# EAGLE schematic mcs-1-32 (EAGLE 6.5.0)

## Sheet 1 of 2
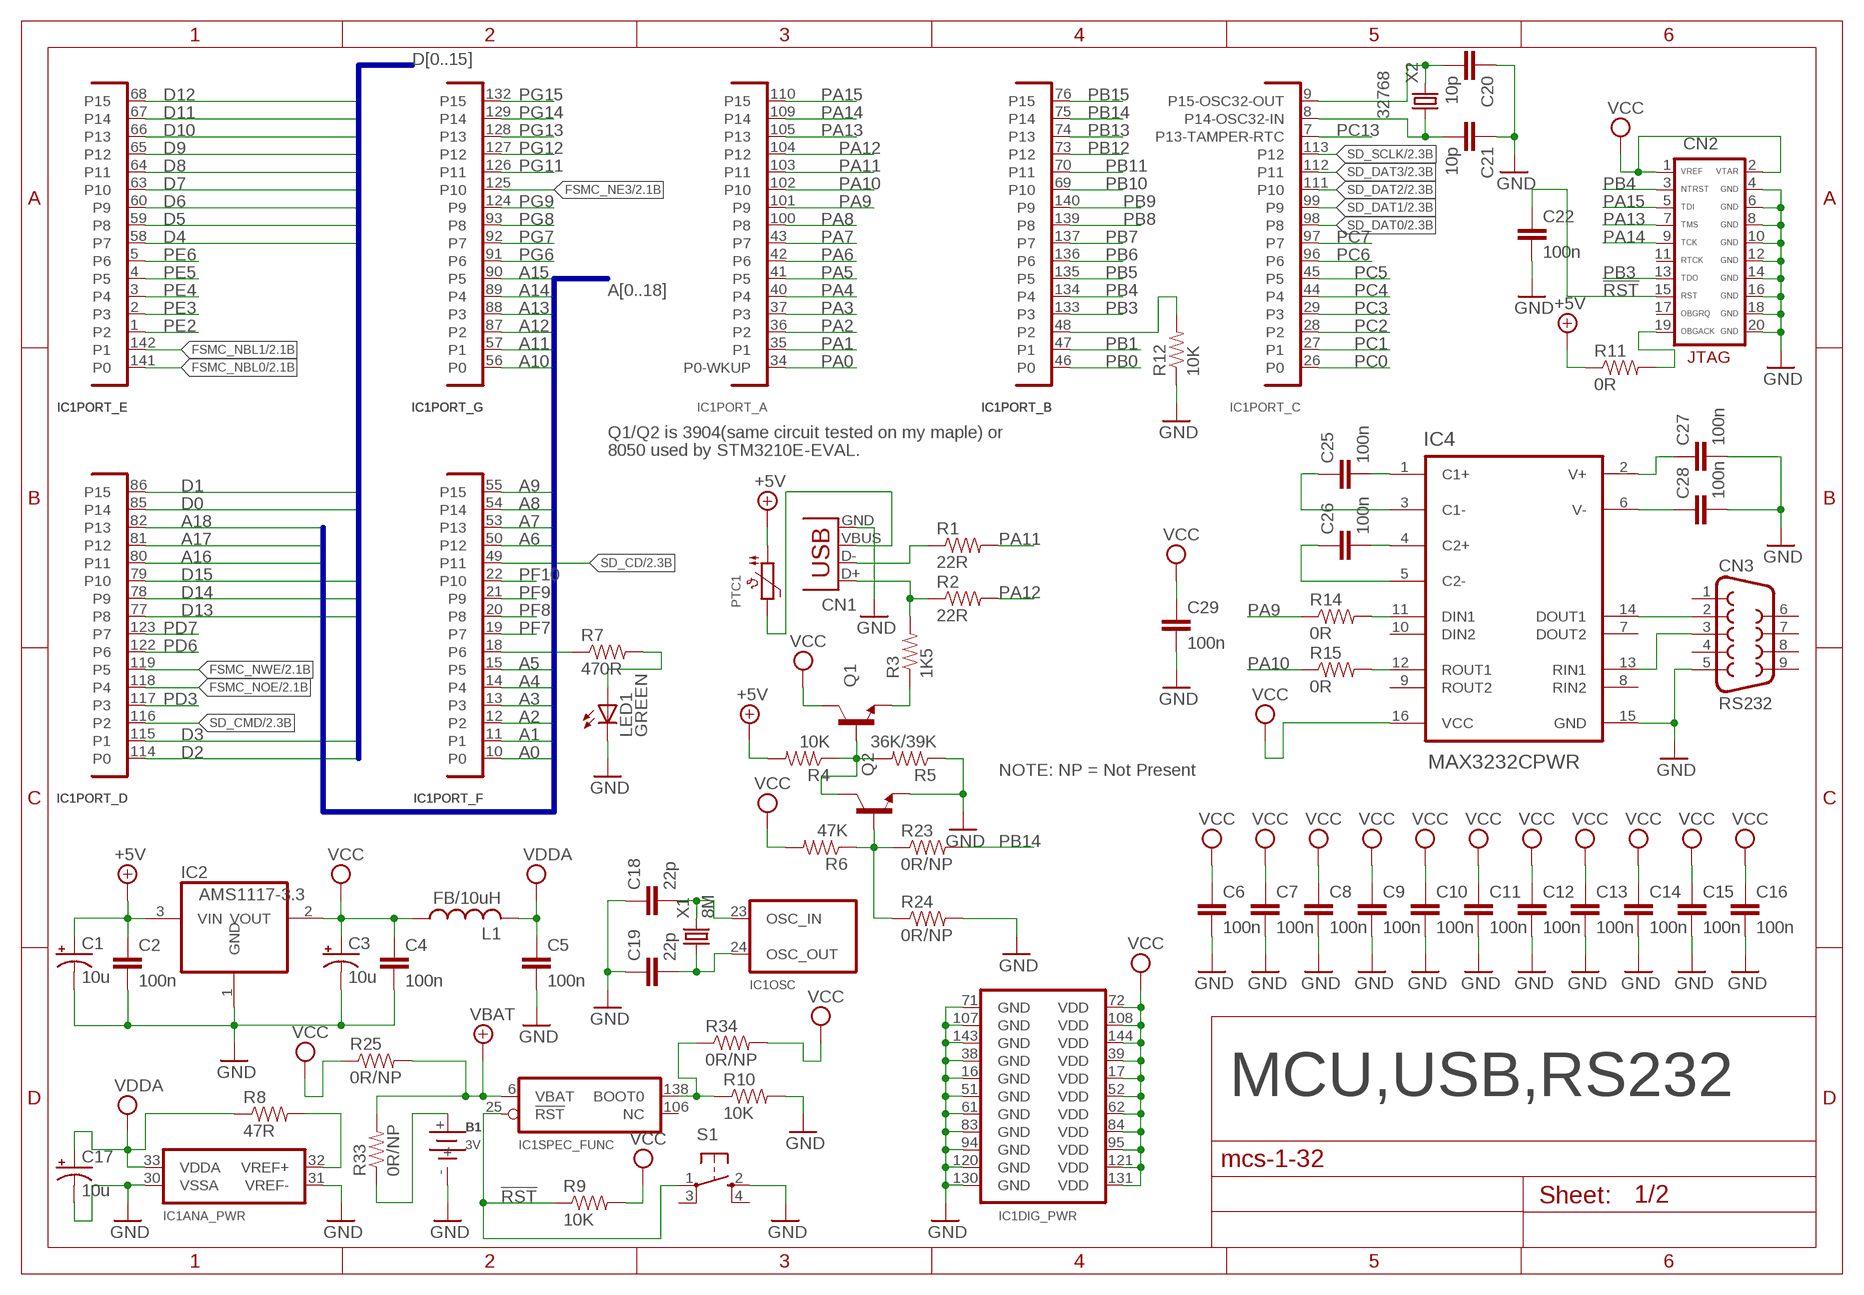
[diagram p0: schematic, sheet 1]

### Parts
B1  3V  BATTERY1220  [1220-SMD]
C1  10u  CAP_POL1206  [EIA3216]
C2  100n  CAP0603-CAP  [0603-CAP]
C3  10u  CAP_POL1206  [EIA3216]
C4  100n  CAP0603-CAP  [0603-CAP]
C5  100n  CAP0603-CAP  [0603-CAP]
C6  100n  CAP0603-CAP  [0603-CAP]
C7  100n  CAP0603-CAP  [0603-CAP]
C8  100n  CAP0603-CAP  [0603-CAP]
C9  100n  CAP0603-CAP  [0603-CAP]
C10  100n  CAP0603-CAP  [0603-CAP]
C11  100n  CAP0603-CAP  [0603-CAP]
C12  100n  CAP0603-CAP  [0603-CAP]
C13  100n  CAP0603-CAP  [0603-CAP]
C14  100n  CAP0603-CAP  [0603-CAP]
C15  100n  CAP0603-CAP  [0603-CAP]
C16  100n  CAP0603-CAP  [0603-CAP]
C17  10u  CAP_POL1206  [EIA3216]
C18  22p  CAP0603-CAP  [0603-CAP]
C19  22p  CAP0603-CAP  [0603-CAP]
C20  10p  CAP0603-CAP  [0603-CAP]
C21  10p  CAP0603-CAP  [0603-CAP]
C22  100n  CAP0603-CAP  [0603-CAP]
C25  100n  CAP0603-CAP  [0603-CAP]
C26  100n  CAP0603-CAP  [0603-CAP]
C27  100n  CAP0603-CAP  [0603-CAP]
C28  100n  CAP0603-CAP  [0603-CAP]
C29  100n  CAP0603-CAP  [0603-CAP]
CN1  USBSMD  [USB-MINIB]
CN2  JTAG-ARM-HDR100  [JTAG-ARM]
CN3  RS232  DB9FEMALE  [DB9]
IC1  STM32F103ZE  [SQFP-S-20X20-144]
IC2  AMS1117-3.3  [BURR-BROWN_SOT223]
IC4  MAX3232CPWR  [SOP65P640X120-16N]
L1  FB/10uH  L-USL2012C  [L2012C]
LED1  GREEN  LED  [CHIPLED_0805]
PTC1  PTCPTC0805  [PTC0805]
Q1  TRANSISTOR_NPNSOT23-3  [SOT23-3]
Q2  TRANSISTOR_NPNSOT23-3  [SOT23-3]
R1  22R  RESISTOR0603-RES  [0603-RES]
R2  22R  RESISTOR0603-RES  [0603-RES]
R3  1K5  RESISTOR0603-RES  [0603-RES]
R4  10K  RESISTOR0603-RES  [0603-RES]
R5  36K/39K  RESISTOR0603-RES  [0603-RES]
R6  47K  RESISTOR0603-RES  [0603-RES]
R7  470R  RESISTOR0603-RES  [0603-RES]
R8  47R  RESISTOR0603-RES  [0603-RES]
R9  10K  RESISTOR0603-RES  [0603-RES]
R10  10K  RESISTOR0603-RES  [0603-RES]
R11  0R  RESISTOR0603-RES  [0603-RES]
R12  10K  RESISTOR0603-RES  [0603-RES]
R14  0R  RESISTOR0603-RES  [0603-RES]
R15  0R  RESISTOR0603-RES  [0603-RES]
R23  0R/NP  RESISTOR0603-RES  [0603-RES]
R24  0R/NP  RESISTOR0603-RES  [0603-RES]
R25  0R/NP  RESISTOR0603-RES  [0603-RES]
R33  0R/NP  RESISTOR0603-RES  [0603-RES]
R34  0R/NP  RESISTOR0603-RES  [0603-RES]
S1  SWITCH-TACT_SFKHHM  [SWITCH-TACT_SFKHHM]
X1  8M  CRYSTALHC49US  [HC49US]
X2  32768  CRYSTAL  [CRYSTAL-32KHZ-3215]

### Nets
!RST: C22.1 CN2.15(RST) IC1.25(SPEC_FUNC:!RST) R9.1 S1.1
+5V [power_in]: C1.A(+) C2.1 IC2.3(VIN) PTC1.1 R4.2 R11.1 ; also sheet 2
A0: IC1.10(PORT_F:P0) ; also sheet 2
A1: IC1.11(PORT_F:P1) ; also sheet 2
A2: IC1.12(PORT_F:P2) ; also sheet 2
A3: IC1.13(PORT_F:P3) ; also sheet 2
A4: IC1.14(PORT_F:P4) ; also sheet 2
A5: IC1.15(PORT_F:P5) ; also sheet 2
A6: IC1.50(PORT_F:P12) ; also sheet 2
A7: IC1.53(PORT_F:P13) ; also sheet 2
A8: IC1.54(PORT_F:P14) ; also sheet 2
A9: IC1.55(PORT_F:P15) ; also sheet 2
A10: IC1.56(PORT_G:P0) ; also sheet 2
A11: IC1.57(PORT_G:P1) ; also sheet 2
A12: IC1.87(PORT_G:P2) ; also sheet 2
A13: IC1.88(PORT_G:P3) ; also sheet 2
A14: IC1.89(PORT_G:P4) ; also sheet 2
A15: IC1.90(PORT_G:P5) ; also sheet 2
A16: IC1.80(PORT_D:P11) ; also sheet 2
A17: IC1.81(PORT_D:P12) ; also sheet 2
A18: IC1.82(PORT_D:P13) ; also sheet 2
D0: IC1.85(PORT_D:P14) ; also sheet 2
D1: IC1.86(PORT_D:P15) ; also sheet 2
D2: IC1.114(PORT_D:P0) ; also sheet 2
D3: IC1.115(PORT_D:P1) ; also sheet 2
D4: IC1.58(PORT_E:P7) ; also sheet 2
D5: IC1.59(PORT_E:P8) ; also sheet 2
D6: IC1.60(PORT_E:P9) ; also sheet 2
D7: IC1.63(PORT_E:P10) ; also sheet 2
D8: IC1.64(PORT_E:P11) ; also sheet 2
D9: IC1.65(PORT_E:P12) ; also sheet 2
D10: IC1.66(PORT_E:P13) ; also sheet 2
D11: IC1.67(PORT_E:P14) ; also sheet 2
D12: IC1.68(PORT_E:P15) ; also sheet 2
D13: IC1.77(PORT_D:P8) ; also sheet 2
D14: IC1.78(PORT_D:P9) ; also sheet 2
D15: IC1.79(PORT_D:P10) ; also sheet 2
FSMC_NBL0: IC1.141(PORT_E:P0) ; also sheet 2
FSMC_NBL1: IC1.142(PORT_E:P1) ; also sheet 2
FSMC_NE3: IC1.125(PORT_G:P10) ; also sheet 2
FSMC_NOE: IC1.118(PORT_D:P4) ; also sheet 2
FSMC_NWE: IC1.119(PORT_D:P5) ; also sheet 2
GND: B1.- C1.C(-) C2.2 C3.C(-) C4.2 C5.2 C6.2 C7.2 C8.2 C9.2 C10.2 C11.2 C12.2 C13.2 C14.2 C15.2 C16.2 C17.C(-) C18.1 C19.1 C20.1 C21.1 C22.2 C27.2 C28.2 C29.2 CN1.GND CN2.4(GND) CN2.6(GND) CN2.8(GND) CN2.10(GND) CN2.12(GND) CN2.14(GND) CN2.16(GND) CN2.18(GND) CN2.20(GND) CN3.5 IC1.16(DIG_PWR:GND) IC1.30(ANA_PWR:VSSA) IC1.31(ANA_PWR:VREF-) IC1.38(DIG_PWR:GND) IC1.51(DIG_PWR:GND) IC1.61(DIG_PWR:GND) IC1.71(DIG_PWR:GND) IC1.83(DIG_PWR:GND) IC1.94(DIG_PWR:GND) IC1.107(DIG_PWR:GND) IC1.120(DIG_PWR:GND) IC1.130(DIG_PWR:GND) IC1.143(DIG_PWR:GND) IC2.1(GND) IC4.15(GND) LED1.C Q2.2(E) R5.1 R10.2 R12.1 R24.2 S1.2 ; also sheet 2
N$1: Q1.2(E) R3.1
N$2: Q1.1(B) Q2.3(C) R4.1 R5.2
N$3: Q2.1(B) R6.1 R23.1 R24.1
N$4: CN1.D- R1.1
N$5: CN1.D+ R2.1 R3.2
N$6: IC1.18(PORT_F:P6) R7.1
N$7: LED1.A R7.2
N$8: IC1.32(ANA_PWR:VREF+) R8.2
N$9: IC1.138(SPEC_FUNC:BOOT0) R10.1 R34.1
N$10: IC1.48(PORT_B:P2) R12.2
N$11: B1.+ R33.1
N$12: C18.2 IC1.23(OSC:OSC_IN) X1.2
N$13: C19.2 IC1.24(OSC:OSC_OUT) X1.1
N$14: C20.2 IC1.9(PORT_C:P15-OSC32-OUT) X2.2
N$15: C21.2 IC1.8(PORT_C:P14-OSC32-IN) X2.1
N$16: CN2.19(OBGACK) R11.2
N$17: IC4.11(DIN1) R14.2
N$18: IC4.12(ROUT1) R15.2
N$19 [power]: CN1.VBUS PTC1.2
N$20: CN3.2 IC4.14(DOUT1)
N$21: CN3.3 IC4.13(RIN1)
N$23: C25.2 IC4.1(C1+)
N$24: C25.1 IC4.3(C1-)
N$25: C26.2 IC4.4(C2+)
N$26: C26.1 IC4.5(C2-)
N$27: C27.1 IC4.2(V+)
N$28: C28.1 IC4.6(V-)
PA0: IC1.34(PORT_A:P0-WKUP) ; also sheet 2
PA1: IC1.35(PORT_A:P1) ; also sheet 2
PA2: IC1.36(PORT_A:P2) ; also sheet 2
PA3: IC1.37(PORT_A:P3) ; also sheet 2
PA4: IC1.40(PORT_A:P4) ; also sheet 2
PA5: IC1.41(PORT_A:P5) ; also sheet 2
PA6: IC1.42(PORT_A:P6) ; also sheet 2
PA7: IC1.43(PORT_A:P7) ; also sheet 2
PA8: IC1.100(PORT_A:P8) ; also sheet 2
PA9: IC1.101(PORT_A:P9) R14.1
PA10: IC1.102(PORT_A:P10) R15.1
PA11: IC1.103(PORT_A:P11) R1.2
PA12: IC1.104(PORT_A:P12) R2.2
PA13: CN2.7(TMS) IC1.105(PORT_A:P13)
PA14: CN2.9(TCK) IC1.109(PORT_A:P14)
PA15: CN2.5(TDI) IC1.110(PORT_A:P15)
PB0: IC1.46(PORT_B:P0) ; also sheet 2
PB1: IC1.47(PORT_B:P1) ; also sheet 2
PB3: CN2.13(TDO) IC1.133(PORT_B:P3)
PB4: CN2.3(NTRST) IC1.134(PORT_B:P4)
PB5: IC1.135(PORT_B:P5) ; also sheet 2
PB6: IC1.136(PORT_B:P6) ; also sheet 2
PB7: IC1.137(PORT_B:P7) ; also sheet 2
PB8: IC1.139(PORT_B:P8) ; also sheet 2
PB9: IC1.140(PORT_B:P9) ; also sheet 2
PB10: IC1.69(PORT_B:P10) ; also sheet 2
PB11: IC1.70(PORT_B:P11) ; also sheet 2
PB12: IC1.73(PORT_B:P12) ; also sheet 2
PB13: IC1.74(PORT_B:P13) ; also sheet 2
PB14: IC1.75(PORT_B:P14) R23.2 ; also sheet 2
PB15: IC1.76(PORT_B:P15) ; also sheet 2
PC0: IC1.26(PORT_C:P0) ; also sheet 2
PC1: IC1.27(PORT_C:P1) ; also sheet 2
PC2: IC1.28(PORT_C:P2) ; also sheet 2
PC3: IC1.29(PORT_C:P3) ; also sheet 2
PC4: IC1.44(PORT_C:P4) ; also sheet 2
PC5: IC1.45(PORT_C:P5) ; also sheet 2
PC6: IC1.96(PORT_C:P6) ; also sheet 2
PC7: IC1.97(PORT_C:P7) ; also sheet 2
PC13: IC1.7(PORT_C:P13-TAMPER-RTC) ; also sheet 2
PD3: IC1.117(PORT_D:P3) ; also sheet 2
PD6: IC1.122(PORT_D:P6) ; also sheet 2
PD7: IC1.123(PORT_D:P7) ; also sheet 2
PE2: IC1.1(PORT_E:P2) ; also sheet 2
PE3: IC1.2(PORT_E:P3) ; also sheet 2
PE4: IC1.3(PORT_E:P4) ; also sheet 2
PE5: IC1.4(PORT_E:P5) ; also sheet 2
PE6: IC1.5(PORT_E:P6) ; also sheet 2
PF7: IC1.19(PORT_F:P7) ; also sheet 2
PF8: IC1.20(PORT_F:P8) ; also sheet 2
PF9: IC1.21(PORT_F:P9) ; also sheet 2
PF10: IC1.22(PORT_F:P10) ; also sheet 2
PG6: IC1.91(PORT_G:P6) ; also sheet 2
PG7: IC1.92(PORT_G:P7) ; also sheet 2
PG8: IC1.93(PORT_G:P8) ; also sheet 2
PG9: IC1.124(PORT_G:P9) ; also sheet 2
PG11: IC1.126(PORT_G:P11) ; also sheet 2
PG12: IC1.127(PORT_G:P12) ; also sheet 2
PG13: IC1.128(PORT_G:P13) ; also sheet 2
PG14: IC1.129(PORT_G:P14) ; also sheet 2
PG15: IC1.132(PORT_G:P15) ; also sheet 2
SD_CD: IC1.49(PORT_F:P11) ; also sheet 2
SD_CMD: IC1.116(PORT_D:P2) ; also sheet 2
SD_DAT0: IC1.98(PORT_C:P8) ; also sheet 2
SD_DAT1: IC1.99(PORT_C:P9) ; also sheet 2
SD_DAT2: IC1.111(PORT_C:P10) ; also sheet 2
SD_DAT3: IC1.112(PORT_C:P11) ; also sheet 2
SD_SCLK: IC1.113(PORT_C:P12) ; also sheet 2
VBAT [power]: IC1.6(SPEC_FUNC:VBAT) R25.2 R33.2
VCC [power]: C3.A(+) C4.1 C6.1 C7.1 C8.1 C9.1 C10.1 C11.1 C12.1 C13.1 C14.1 C15.1 C16.1 C29.1 CN2.1(VREF) CN2.2(VTAR) IC1.17(DIG_PWR:VDD) IC1.39(DIG_PWR:VDD) IC1.52(DIG_PWR:VDD) IC1.62(DIG_PWR:VDD) IC1.72(DIG_PWR:VDD) IC1.84(DIG_PWR:VDD) IC1.95(DIG_PWR:VDD) IC1.108(DIG_PWR:VDD) IC1.121(DIG_PWR:VDD) IC1.131(DIG_PWR:VDD) IC1.144(DIG_PWR:VDD) IC2.2(VOUT) IC4.16(VCC) L1.1 Q1.3(C) R6.2 R9.2 R25.1 R34.2 ; also sheet 2
VDDA [power]: C5.1 C17.A(+) IC1.33(ANA_PWR:VDDA) L1.2 R8.1
Unconnected: CN2.11(RTCK) CN2.17(OBGRQ) CN3.1 CN3.4 CN3.6 CN3.7 CN3.8 CN3.9 IC1.106(SPEC_FUNC:NC) IC4.7(DOUT2) IC4.8(RIN2) IC4.9(ROUT2) IC4.10(DIN2) S1.3 S1.4

### Buses
D[0..15]
A[0..18]

### Notes on the sheet
- Q1/Q2 is 3904(same circuit tested on my maple) or
- 8050 used by STM3210E-EVAL.
- NOTE: NP = Not Present
- MCU,USB,RS232

## Sheet 2 of 2
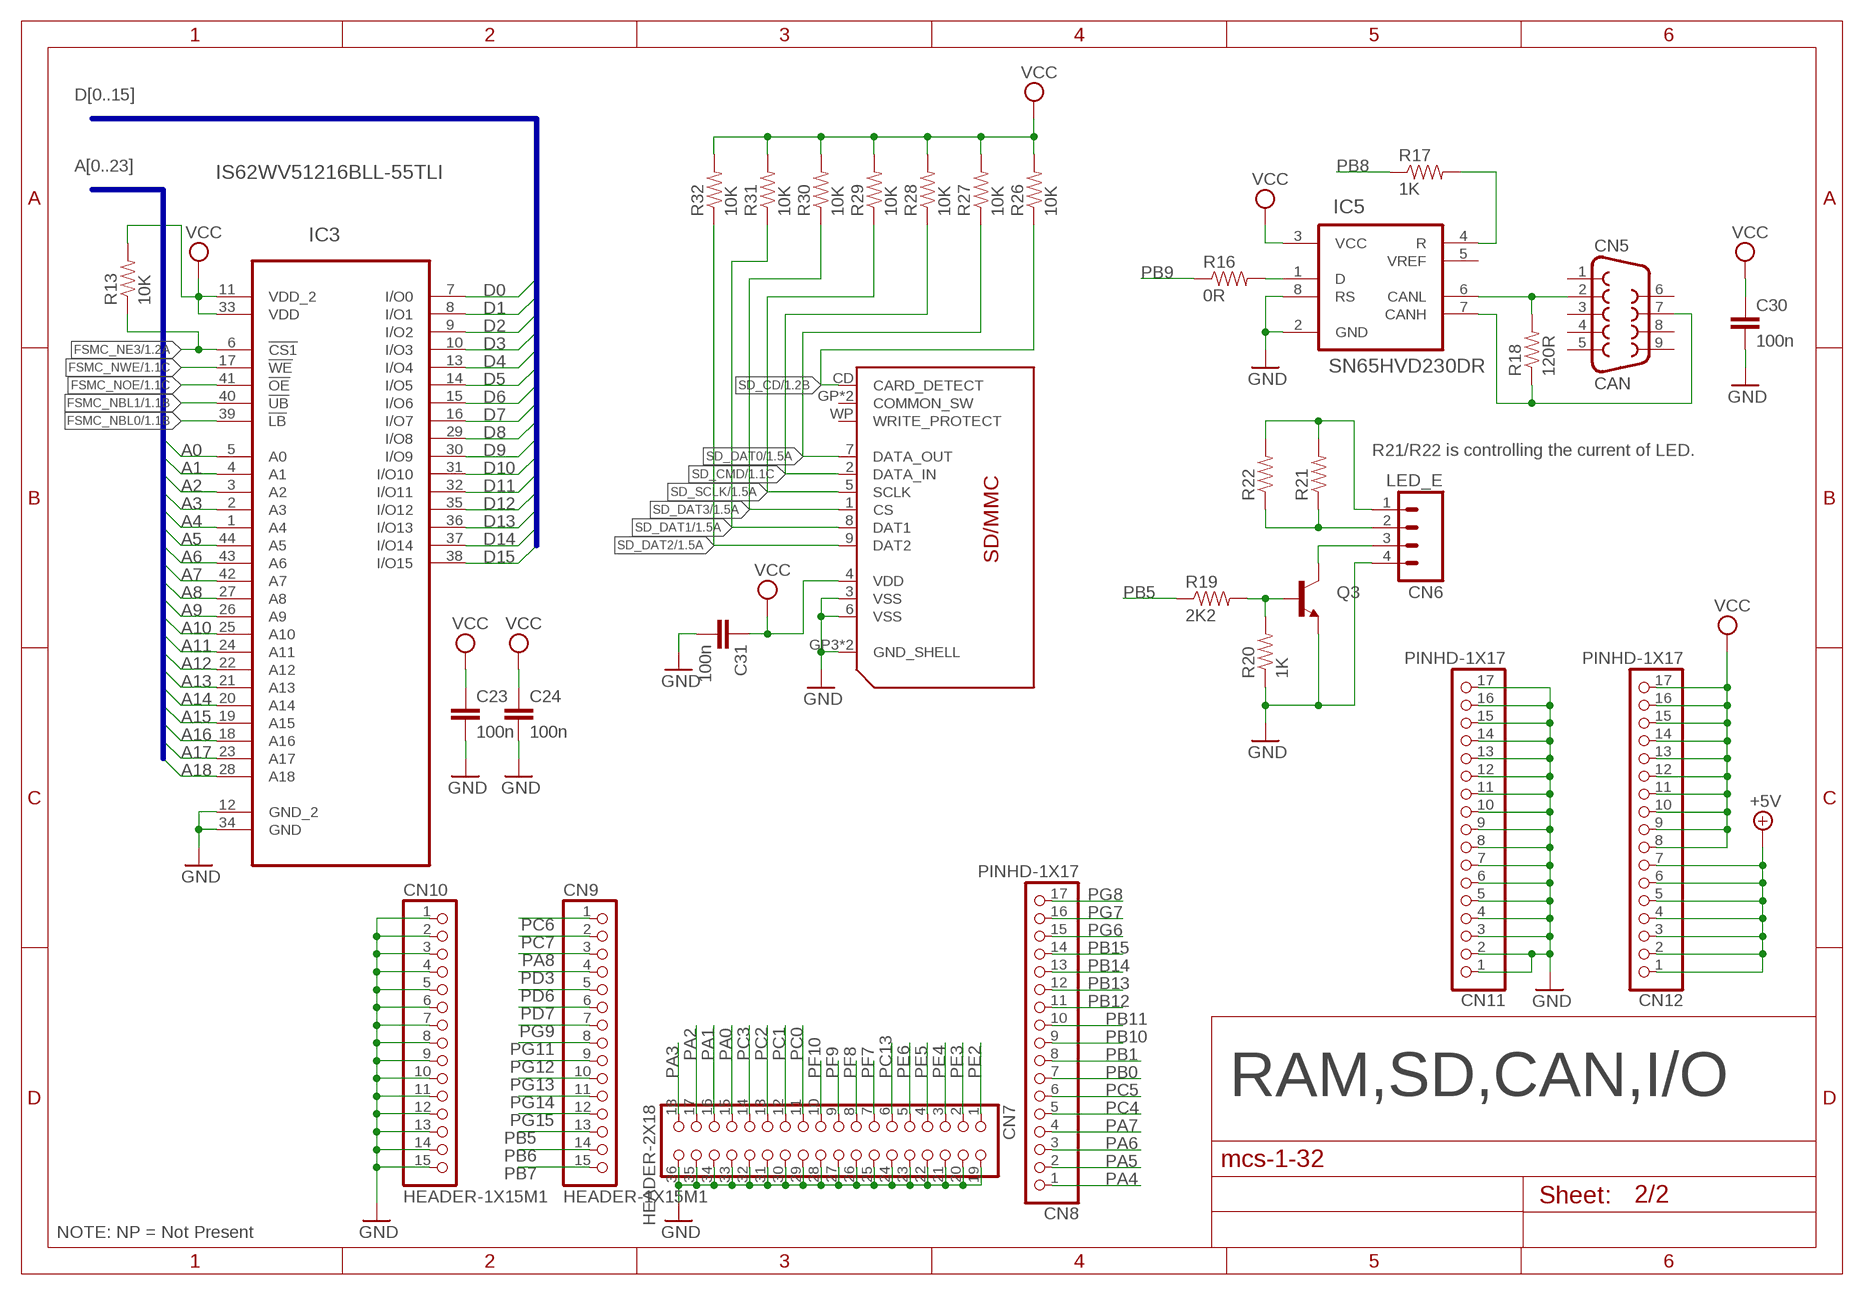
[diagram p1: schematic, sheet 2]

### Parts
C23  100n  CAP0603-CAP  [0603-CAP]
C24  100n  CAP0603-CAP  [0603-CAP]
C30  100n  CAP0603-CAP  [0603-CAP]
C31  100n  CAP0603-CAP  [0603-CAP]
CN4  SDMMC06132  [06132]
CN5  CAN  DB9MALE  [DB9_MALE]
CN6  LED_E  M04UNI  [1X04_NS]
CN7  HEADER-2X18  [2X18U]
CN8  PINHD-1X17  [1X17M1]
CN9  HEADER-1X15M1  [1X15M1]
CN10  HEADER-1X15M1  [1X15M1]
CN11  PINHD-1X17  [1X17M1]
CN12  PINHD-1X17  [1X17M1]
IC3  IS62WV51216BLL-55TLI  [SOP80P1176X120-44N]
IC5  SN65HVD230DR  [SOIC127P600X175-8N]
Q3  TRANSISTOR_NPNSOT23-3  [SOT23-3]
R13  10K  RESISTOR0603-RES  [0603-RES]
R16  0R  RESISTOR0603-RES  [0603-RES]
R17  1K  RESISTOR0603-RES  [0603-RES]
R18  120R  RESISTOR0603-RES  [0603-RES]
R19  2K2  RESISTOR0603-RES  [0603-RES]
R20  1K  RESISTOR0603-RES  [0603-RES]
R21  RESISTOR0603-RES  [0603-RES]
R22  RESISTOR0603-RES  [0603-RES]
R26  10K  RESISTOR0603-RES  [0603-RES]
R27  10K  RESISTOR0603-RES  [0603-RES]
R28  10K  RESISTOR0603-RES  [0603-RES]
R29  10K  RESISTOR0603-RES  [0603-RES]
R30  10K  RESISTOR0603-RES  [0603-RES]
R31  10K  RESISTOR0603-RES  [0603-RES]
R32  10K  RESISTOR0603-RES  [0603-RES]

### Nets
+5V [power_in]: CN12.1 CN12.2 CN12.3 CN12.4 CN12.5 CN12.6 CN12.7 ; also sheet 1
A0: IC3.5(A0) ; also sheet 1
A1: IC3.4(A1) ; also sheet 1
A2: IC3.3(A2) ; also sheet 1
A3: IC3.2(A3) ; also sheet 1
A4: IC3.1(A4) ; also sheet 1
A5: IC3.44(A5) ; also sheet 1
A6: IC3.43(A6) ; also sheet 1
A7: IC3.42(A7) ; also sheet 1
A8: IC3.27(A8) ; also sheet 1
A9: IC3.26(A9) ; also sheet 1
A10: IC3.25(A10) ; also sheet 1
A11: IC3.24(A11) ; also sheet 1
A12: IC3.22(A12) ; also sheet 1
A13: IC3.21(A13) ; also sheet 1
A14: IC3.20(A14) ; also sheet 1
A15: IC3.19(A15) ; also sheet 1
A16: IC3.18(A16) ; also sheet 1
A17: IC3.23(A17) ; also sheet 1
A18: IC3.28(A18) ; also sheet 1
D0: IC3.7(I/O0) ; also sheet 1
D1: IC3.8(I/O1) ; also sheet 1
D2: IC3.9(I/O2) ; also sheet 1
D3: IC3.10(I/O3) ; also sheet 1
D4: IC3.13(I/O4) ; also sheet 1
D5: IC3.14(I/O5) ; also sheet 1
D6: IC3.15(I/O6) ; also sheet 1
D7: IC3.16(I/O7) ; also sheet 1
D8: IC3.29(I/O8) ; also sheet 1
D9: IC3.30(I/O9) ; also sheet 1
D10: IC3.31(I/O10) ; also sheet 1
D11: IC3.32(I/O11) ; also sheet 1
D12: IC3.35(I/O12) ; also sheet 1
D13: IC3.36(I/O13) ; also sheet 1
D14: IC3.37(I/O14) ; also sheet 1
D15: IC3.38(I/O15) ; also sheet 1
FSMC_NBL0: IC3.39(!LB) ; also sheet 1
FSMC_NBL1: IC3.40(!UB) ; also sheet 1
FSMC_NE3: IC3.6(!CS1) R13.1 ; also sheet 1
FSMC_NOE: IC3.41(!OE) ; also sheet 1
FSMC_NWE: IC3.17(!WE) ; also sheet 1
GND: C23.2 C24.2 C30.2 C31.2 CN4.3(VSS) CN4.6(VSS) CN4.GP3(GND_SHELL) CN4.GP4(GND_SHELL) CN6.4 CN7.19 CN7.20 CN7.21 CN7.22 CN7.23 CN7.24 CN7.25 CN7.26 CN7.27 CN7.28 CN7.29 CN7.30 CN7.31 CN7.32 CN7.33 CN7.34 CN7.35 CN7.36 CN10.1 CN10.2 CN10.3 CN10.4 CN10.5 CN10.6 CN10.7 CN10.8 CN10.9 CN10.10 CN10.11 CN10.12 CN10.13 CN10.14 CN10.15 CN11.1 CN11.2 CN11.3 CN11.4 CN11.5 CN11.6 CN11.7 CN11.8 CN11.9 CN11.10 CN11.11 CN11.12 CN11.13 CN11.14 CN11.15 CN11.16 CN11.17 IC3.12(GND_2) IC3.34(GND) IC5.2(GND) IC5.8(RS) Q3.2(E) R20.1 ; also sheet 1
N$22: IC5.1(D) R16.2
N$29: IC5.4(R) R17.2
N$30: CN5.2 IC5.6(CANL) R18.2
N$31: CN5.7 IC5.7(CANH) R18.1
N$32: Q3.1(B) R19.2 R20.2
N$34 [power_in]: CN6.1 R21.2 R22.2
N$35 [power_in]: CN6.2 R21.1 R22.1
N$36 [power_in]: CN6.3 Q3.3(C)
PA0: CN7.15 ; also sheet 1
PA1: CN7.16 ; also sheet 1
PA2: CN7.17 ; also sheet 1
PA3: CN7.18 ; also sheet 1
PA4: CN8.1 ; also sheet 1
PA5: CN8.2 ; also sheet 1
PA6: CN8.3 ; also sheet 1
PA7: CN8.4 ; also sheet 1
PA8: CN9.3 ; also sheet 1
PB0: CN8.7 ; also sheet 1
PB1: CN8.8 ; also sheet 1
PB5: CN9.13 R19.1 ; also sheet 1
PB6: CN9.14 ; also sheet 1
PB7: CN9.15 ; also sheet 1
PB8: R17.1 ; also sheet 1
PB9: R16.1 ; also sheet 1
PB10: CN8.9 ; also sheet 1
PB11: CN8.10 ; also sheet 1
PB12: CN8.11 ; also sheet 1
PB13: CN8.12 ; also sheet 1
PB14: CN8.13 ; also sheet 1
PB15: CN8.14 ; also sheet 1
PC0: CN7.11 ; also sheet 1
PC1: CN7.12 ; also sheet 1
PC2: CN7.13 ; also sheet 1
PC3: CN7.14 ; also sheet 1
PC4: CN8.5 ; also sheet 1
PC5: CN8.6 ; also sheet 1
PC6: CN9.1 ; also sheet 1
PC7: CN9.2 ; also sheet 1
PC13: CN7.6 ; also sheet 1
PD3: CN9.4 ; also sheet 1
PD6: CN9.5 ; also sheet 1
PD7: CN9.6 ; also sheet 1
PE2: CN7.1 ; also sheet 1
PE3: CN7.2 ; also sheet 1
PE4: CN7.3 ; also sheet 1
PE5: CN7.4 ; also sheet 1
PE6: CN7.5 ; also sheet 1
PF7: CN7.7 ; also sheet 1
PF8: CN7.8 ; also sheet 1
PF9: CN7.9 ; also sheet 1
PF10: CN7.10 ; also sheet 1
PG6: CN8.15 ; also sheet 1
PG7: CN8.16 ; also sheet 1
PG8: CN8.17 ; also sheet 1
PG9: CN9.7 ; also sheet 1
PG11: CN9.8 ; also sheet 1
PG12: CN9.9 ; also sheet 1
PG13: CN9.10 ; also sheet 1
PG14: CN9.11 ; also sheet 1
PG15: CN9.12 ; also sheet 1
SD_CD: CN4.CD(CARD_DETECT) R26.1 ; also sheet 1
SD_CMD: CN4.2(DATA_IN) R28.1 ; also sheet 1
SD_DAT0: CN4.7(DATA_OUT) R27.1 ; also sheet 1
SD_DAT1: CN4.8(DAT1) R31.1 ; also sheet 1
SD_DAT2: CN4.9(DAT2) R32.1 ; also sheet 1
SD_DAT3: CN4.1(CS) R30.1 ; also sheet 1
SD_SCLK: CN4.5(SCLK) R29.1 ; also sheet 1
VCC [power]: C23.1 C24.1 C30.1 C31.1 CN4.4(VDD) CN12.8 CN12.9 CN12.10 CN12.11 CN12.12 CN12.13 CN12.14 CN12.15 CN12.16 CN12.17 IC3.11(VDD_2) IC3.33(VDD) IC5.3(VCC) R13.2 R26.2 R27.2 R28.2 R29.2 R30.2 R31.2 R32.2 ; also sheet 1
Unconnected: CN4.GP2(COMMON_SW) CN4.GP(COMMON_SW) CN4.WP(WRITE_PROTECT) CN5.1 CN5.3 CN5.4 CN5.5 CN5.6 CN5.8 CN5.9 IC5.5(VREF)

### Buses
A[0..23]
D[0..15]

### Notes on the sheet
- R21/R22 is controlling the current of LED.
- RAM,SD,CAN,I/O
- NOTE: NP = Not Present

## Library data of the parts
B1 = mcs:BATTERY
C1 C3 C17 = uclinux:CAP_POL: Capacitor Polarized These are standard SMD and PTH capacitors. Normally 10uF, 47uF, and 100uF in electrolytic and tantalum varieties. Always verify the external diameter of the through hole cap, it varies with capacity, voltage, and manufacturer. The EIA devices should be standard.
C2 C4-C16 C18-C31 = uclinux:CAP: Capacitor Standard 0603 ceramic capacitor, and 0.1" leaded capacitor.
CN1 = uclinux:USB: USB Connectors USB-B-PTH is fully proven SKU : PRT-00139 USB-miniB is fully proven SKU : PRT-00587 USB-A-PCB is untested. USB-A-H is throughly reviewed, but untested. Spark Fun Electronics SKU : PRT-00437 USB-B-SMT is throughly reviewed, but untested. Needs silkscreen touching up. USB-A-S has not been used/tested USB-MB-H has not been used/tested
CN2 = uclinux:JTAG-ARM-: JTAG Programming/Debug Connector
CN3 = mcs:DB9: DB9 Connector Standard DB9 (D-Sub 9) serial connector. Can be used for CAN bus as well as RS485 and RS232. Footprint production proven. Spark Fun Electronics SKU : PRT-00429; PROD_ID: CONN-08194
CN4 = uclinux:SDMMC: SD MMC Card holder
CN5 = mcs:DB9: DB9 Connector Standard DB9 (D-Sub 9) serial connector. Can be used for CAN bus as well as RS485 and RS232. Footprint production proven. Spark Fun Electronics SKU : PRT-00429; PROD_ID: CONN-09904
CN6 = mcs:M04
CN7 = mcs:HEADER-2X18
CN8 CN11 CN12 = mcs:PINHD-1X17: Pin header 1x10 0.1" spacing With round pins
CN9 CN10 = mcs:HEADER-1X15
IC1 = uclinux:STM32F103ZE: 72 MHz, 64KB RAM, 512 KB Flash
IC2 = uclinux:AMS1117-3.3: 800mA and 1A Low Dropout (LDO) Positive Regulator 1.8V, 2.5V, 2.85V, 3.3V, 5V, and Adj
IC3 = uclinux:IS62WV51216BLL-55TLI: STATIC SRAM; MPN: IS62WV51216BLL-55TLI; OC_FARNELL: 1869969; OC_NEWARK: 43M5479; PACKAGE: TSSOP-44; SUPPLIER: INTEGRATED SILICON SOLUTION (ISSI)
IC4 = mcs:MAX3232CPWR: RS-232 Line Driver/Receiver; MPN: MAX3232CPWR; OC_FARNELL: 1460372; OC_NEWARK: 75C1004; PACKAGE: TSSOP-16; SUPPLIER: Texas Instruments
IC5 = mcs:SN65HVD230DR: 3.3-V CAN TRANSCEIVERS; MPN: SN65HVD230DR; OC_FARNELL: 8452148; OC_NEWARK: 75C7745; PACKAGE: SOIC-8; SUPPLIER: Texas Instruments
L1 = uclinux:L-US: INDUCTOR, American symbol
LED1 = uclinux:LED: LEDs Standard schematic elements and footprints for 5mm, 3mm, 1206, and 0603 sized LEDs. 5mm - Spark Fun Electronics SKU : COM-00529 (and others)
PTC1 = mcs:PTC: PTC (Resettable Fuse) 1206 Package 250mA PTC (16V Max, Time-to-Trip: 0.08s) - Digikey: F2110CT-ND 1210 Package 100mA PTC (30V Max, Time-to-Trip: 0.6s) - Digikey: MF-USMF010-2CT-ND 1812 Package 750mA PTC (24V Max, Time-to-Trip: 0.2s) - Digikey: MF-MSMF075/24-2CT-ND
Q1-Q3 = uclinux:TRANSISTOR_NPN: Transistor NPN BJT configuration in SOT23 package. MMBT2222 is the common NPN we use. Double check BCE configuration again layout.
R1-R34 = uclinux:RESISTOR: Resistor Basic schematic elements and footprints for 0402, 0603, 0805, 1206, PTH 1/10th watt (small), 0102, 0204, and etc. resistors.
S1 = uclinux:SWITCH-TACT_SFKHHM: Tact Switch made by Forward, Taiwan. Model No. Prefix SFKHHM
X1 X2 = uclinux:CRYSTAL: Crystals Various standard crystals. Proven footprints. Spark Fun Electronics SKU : COM-00534

## Net classes
0 default: width 0.152 mm
1 power_in: width 0.406 mm
2 power: width 0.254 mm